# Altium project NodeMCUProject.PrjPcb
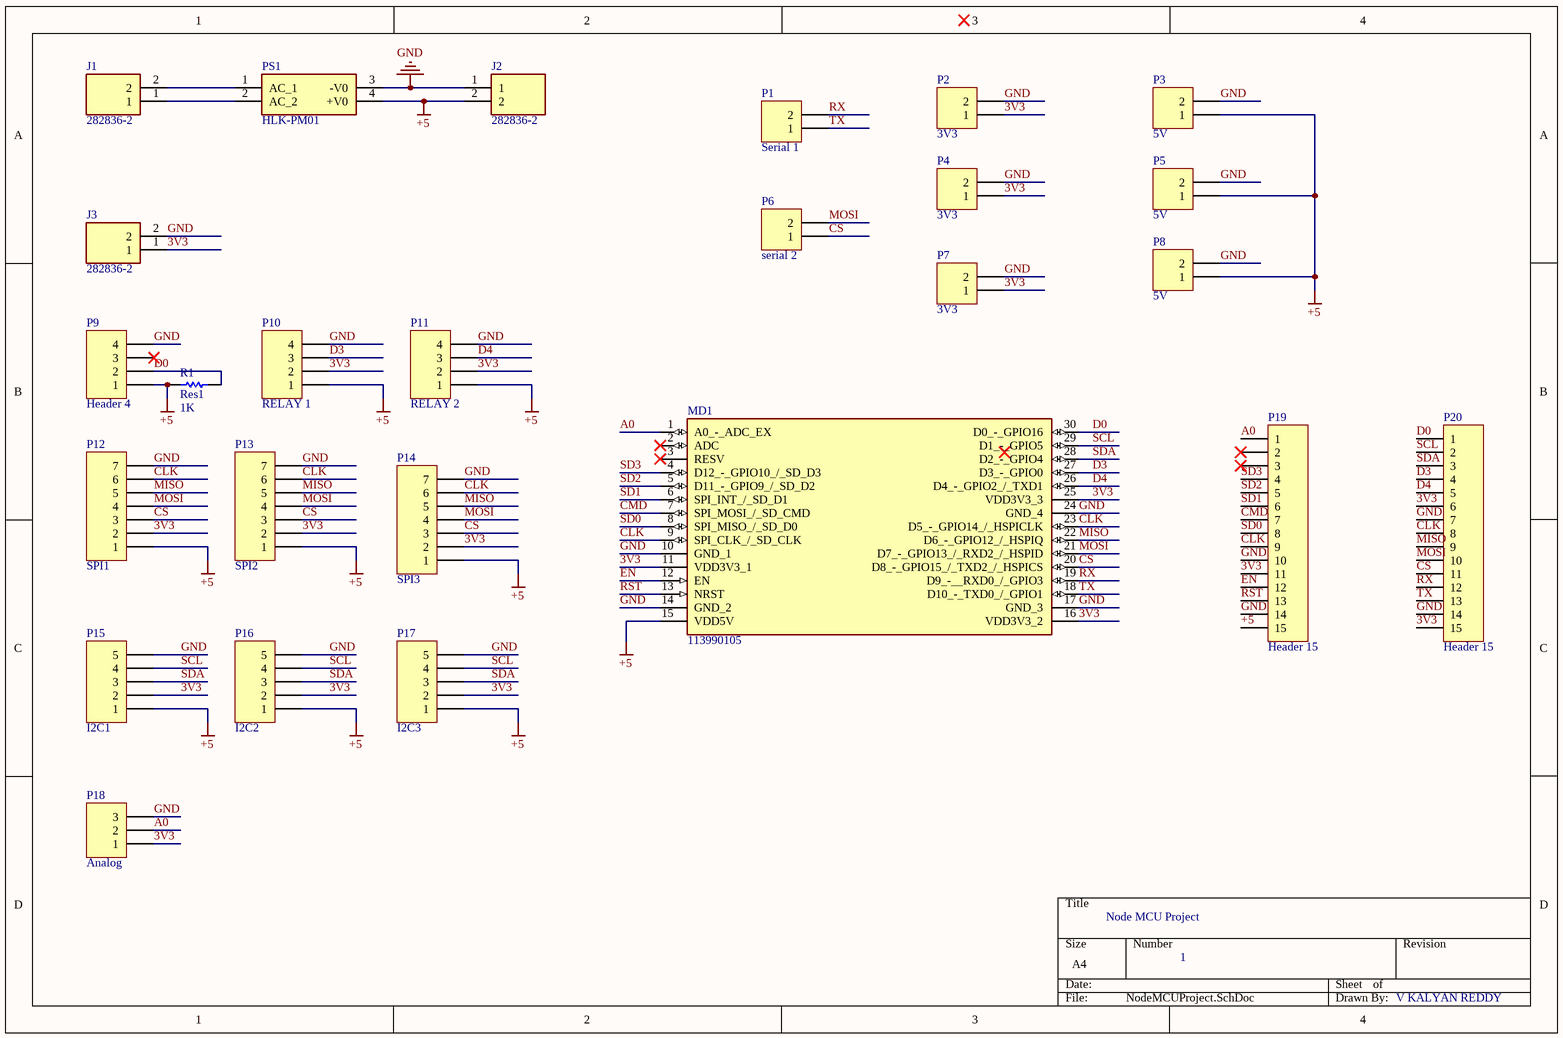
[diagram p0: NodeMCUProject.SchDoc]
1 sheet, 26 parts. Net scope: global (net labels, ports and power ports of the same name join across sheets).
Board file: NodeMCUProject.PcbDoc

## Sheet NodeMCUProject.SchDoc
size A4; SheetNumber: 1; SheetTotal: 1

### Parts
J1  282836-2  [2828362]
J2  282836-2  [2828362]
J3  282836-2  [2828362]
MD1  113990105  [113990105]
P1  Serial 1  [HDR1X2]
P2  3V3  [HDR1X2]
P3  5V  [HDR1X2]
P4  3V3  [HDR1X2]
P5  5V  [HDR1X2]
P6  serial 2  [HDR1X2]
P7  3V3  [HDR1X2]
P8  5V  [HDR1X2]
P9  Header 4  [HDR1X4]
P10  RELAY 1  [HDR1X4]
P11  RELAY 2  [HDR1X4]
P12  SPI1  [HDR1X7]
P13  SPI2  [HDR1X7]
P14  SPI3  [HDR1X7]
P15  I2C1  [HDR1X5]
P16  I2C2  [HDR1X5]
P17  I2C3  [HDR1X5]
P18  Analog  [HDR1X3]
P19  Header 15  [HDR1X15]
P20  Header 15  [HDR1X15]
PS1  HLK-PM01  [HLKPM01]
R1  Res1  value 1K  [AXIAL-0.3]

### Nets
+5: J2.2 MD1.15(VDD5V) P3.1 P5.1 P8.1 P9.1 P10.1 P11.1 P12.1 P13.1 P14.1 P15.1 P16.1 P17.1 P19.15 PS1.4(+V0) R1.1
GND: J2.1 J3.2 MD1.10(GND_1) MD1.14(GND_2) MD1.17(GND_3) MD1.24(GND_4) P2.2 P3.2 P4.2 P5.2 P7.2 P8.2 P9.4 P10.4 P11.4 P12.7 P13.7 P14.7 P15.5 P16.5 P17.5 P18.3 P19.10 P19.14 P20.7 P20.14 PS1.3(-V0)
3V3: J3.1 MD1.11(VDD3V3_1) MD1.16(VDD3V3_2) MD1.25(VDD3V3_3) P2.1 P4.1 P7.1 P10.2 P11.2 P12.2 P13.2 P14.2 P15.2 P16.2 P17.2 P18.1 P19.11 P20.6 P20.15
A0: MD1.1(A0_-_ADC_EX) P18.2 P19.1
CLK: MD1.9(SPI_CLK_/_SD_CLK) MD1.23(D5_-_GPIO14_/_HSPICLK) P12.6 P13.6 P14.6 P19.9 P20.8
CMD: MD1.7(SPI_MOSI_/_SD_CMD) P19.7
CS: MD1.20(D8_-_GPIO15_/_TXD2_/_HSPICS) P6.1 P12.3 P13.3 P14.3 P20.11
D0: MD1.30(D0_-_GPIO16) P9.2 P20.1 R1.2
D3: MD1.27(D3_-_GPIO0) P10.3 P20.4
D4: MD1.26(D4_-_GPIO2_/_TXD1) P11.3 P20.5
EN: MD1.12(EN) P19.12
MISO: MD1.22(D6_-_GPIO12_/_HSPIQ) P12.5 P13.5 P14.5 P20.9
MOSI: MD1.21(D7_-_GPIO13_/_RXD2_/_HSPID) P6.2 P12.4 P13.4 P14.4 P20.10
RST: MD1.13(NRST) P19.13
RX: MD1.19(D9_-__RXD0_/_GPIO3) P1.2 P20.12
SCL: MD1.29(D1_-_GPIO5) P15.4 P16.4 P17.4 P20.2
SD0: MD1.8(SPI_MISO_/_SD_D0) P19.8
SD1: MD1.6(SPI_INT_/_SD_D1) P19.6
SD2: MD1.5(D11_-_GPIO9_/_SD_D2) P19.5
SD3: MD1.4(D12_-_GPIO10_/_SD_D3) P19.4
SDA: MD1.28(D2_-_GPIO4) P15.3 P16.3 P17.3 P20.3
TX: MD1.18(D10_-_TXD0_/_GPIO1) P1.1 P20.13
NetJ1_1: J1.1 PS1.2(AC_2)
NetJ1_2: J1.2 PS1.1(AC_1)

Not connected (* = marked no-connect by the designer): MD1 2(ADC)* 3(RESV)*; P9 3*; P19 2* 3*

### Notes on the sheet
- Node MCU Project
- 1
- V KALYAN REDDY

### Library data of the parts
J1-J3 = 282836-2: Connector; Manufacturer_Name: TE Connectivity; Datasheet Link: https://www.te.com/commerce/DocumentDelivery/DDEController?Action=showdoc&DocId=Customer+Drawing%7F282836%7FJ%7Fpdf%7FEnglish%7FENG_CD_282836_J.pdf%7F282836-2; Height: 10mm; Manufacturer_Part_Number: 282836-2; Mouser Part Number: 571-2828362; Mouser Price/Stock: https://www.mouser.co.uk/ProductDetail/TE-Connectivity/282836-2?qs=A%252Bip%252BNCYi6Ohx9vaQ1l4dg%3D%3D; Arrow Part Number: 282836-2; Arrow Price/Stock: https://www.arrow.com/en/products/282836-2/te-connectivity?region=nac
MD1 = 113990105: Undefined or Miscellaneous; Manufacturer_Name: Seeed Studio; Datasheet Link: https://www.seeedstudio.com/NodeMCU-v2-Lua-based-ESP8266-development-kit.html; Height: 7.35mm; Manufacturer_Part_Number: 113990105; Mouser Part Number: 713-113990105; Mouser Price/Stock: https://www.mouser.co.uk/ProductDetail/Seeed-Studio/113990105?qs=SElPoaY2y5KMx8k1roAIKw%3D%3D; Arrow Part Number: 113990105; Arrow Price/Stock: https://www.arrow.com/en/products/113990105/seeed-technology-limited?region=nac
P1-P8 = Header 2: Header, 2-Pin; LatestRevisionDate: 17-Jul-2002; LatestRevisionNote: Re-released for DXP Platform.; Publisher: Altium Limited
P9-P11 = Header 4: Header, 4-Pin; LatestRevisionDate: 17-Jul-2002; LatestRevisionNote: Re-released for DXP Platform.; Publisher: Altium Limited
P12-P14 = Header 7: Header, 7-Pin; LatestRevisionDate: 17-Jul-2002; LatestRevisionNote: Re-released for DXP Platform.; Publisher: Altium Limited
P15-P17 = Header 5: Header, 5-Pin; LatestRevisionDate: 17-Jul-2002; LatestRevisionNote: Re-released for DXP Platform.; Publisher: Altium Limited
P18 = Header 3: Header, 3-Pin; LatestRevisionDate: 17-Jul-2002; LatestRevisionNote: Re-released for DXP Platform.; Publisher: Altium Limited
P19 P20 = Header 15: Header, 15-Pin; LatestRevisionDate: 17-Jul-2002; LatestRevisionNote: Re-released for DXP Platform.; Publisher: Altium Limited
PS1 = HLK-PM01: Power Supply; Manufacturer_Name: Hi-Link; Datasheet Link: https://datasheet.lcsc.com/szlcsc/1906201102_HI-LINK-HLK-PM03_C209904.pdf; Height: 15mm; Manufacturer_Part_Number: HLK-PM01
R1 = Res1: Resistor; Published: 8-Jun-2000; LatestRevisionDate: 17-Jul-2002; LatestRevisionNote: Re-released for DXP Platform.; PackageReference: AXIAL-0.3; Publisher: Altium Limited; PackageDescription: Axial Device, Thru-Hole; 2 Leads; 0.3 in Pin Spacing